# EasyEDA Pro project MatricClock.eprj

# Schematic Schematic1
Board Name: Board1; Create Date: 2025-01-13; Page Name: P1; Project Name: MatricClock; Schematic Name: Schematic1; Update Date: 2025-01-19; Company: 嘉立创EDA; Page Size: A4; Version: V1.0
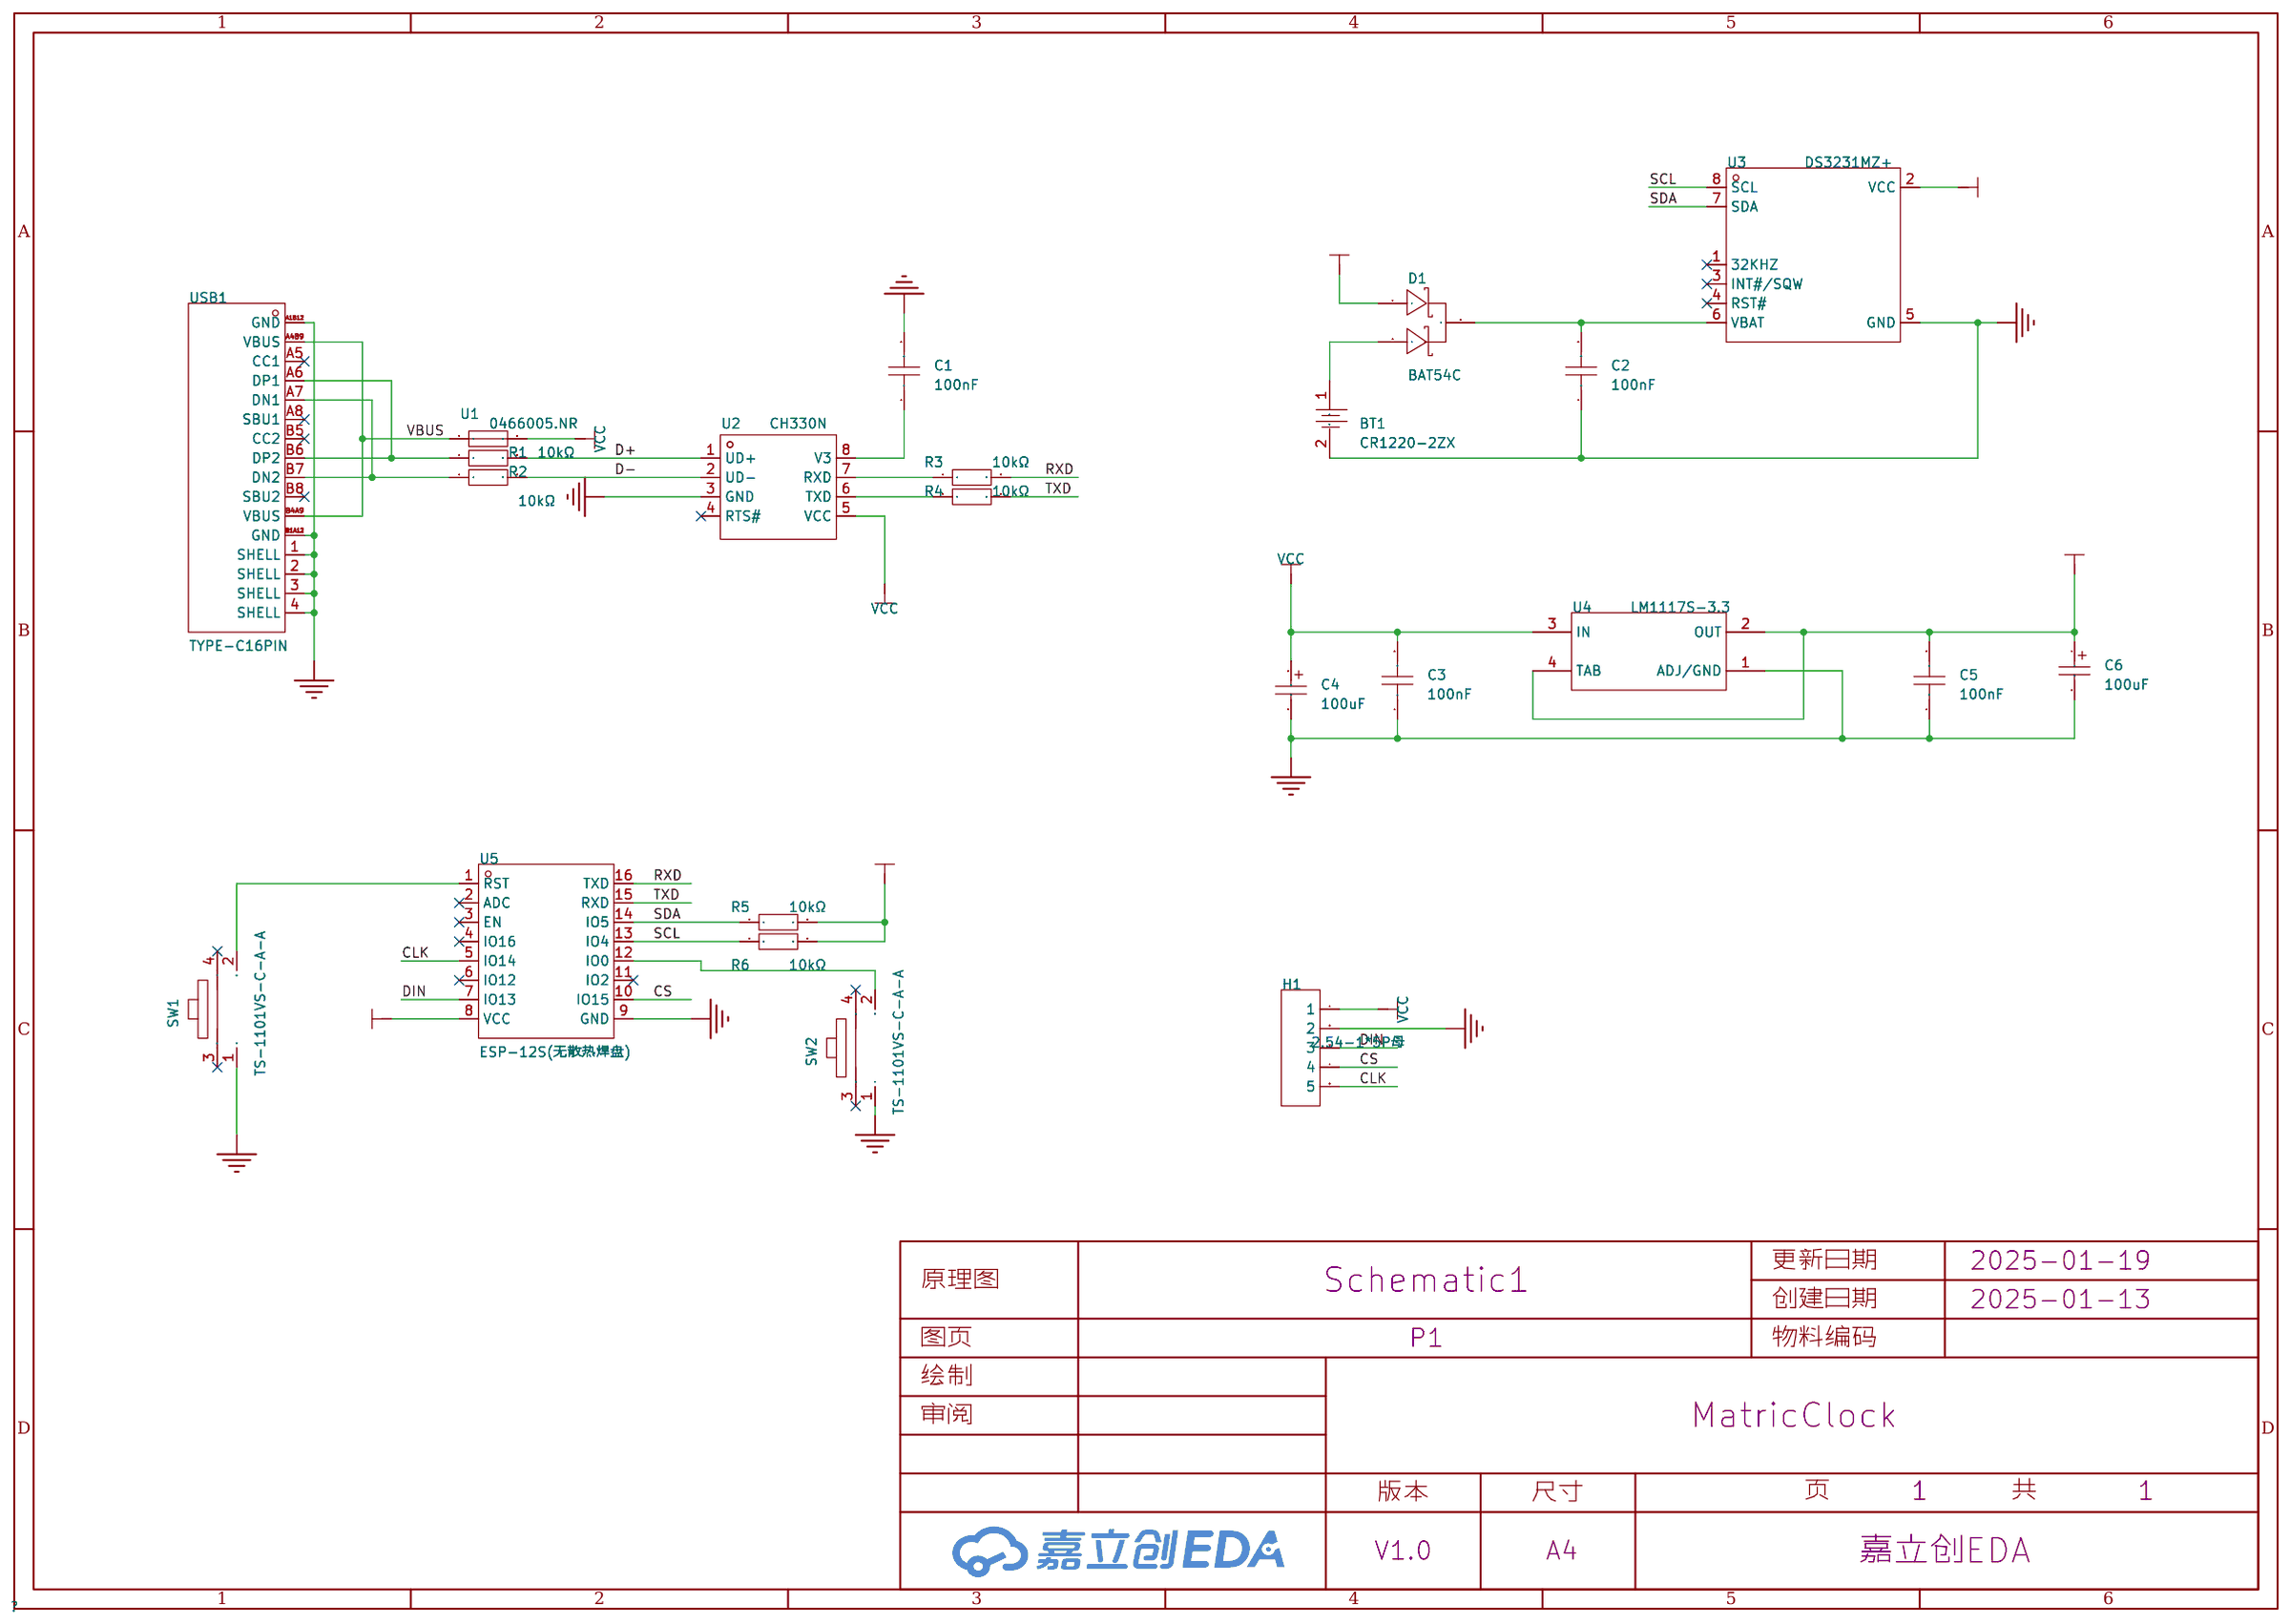
[diagram p0: schematic sheet]

## Parts
BT1  CR1220-2ZX  [BAT-SMD_CR1220-2ZX]
C1  100nF  [C0805]
C2  100nF  [C0805]
C3  100nF  [C0805]
C4  100uF  [CASE-B_3528]
C5  100nF  [C0805]
C6  100uF  [CASE-B_3528]
D1  BAT54C  [SOT-23-3_L3.0-W1.7-P0.95-LS2.9-BR]
H1  2.54-1*5P母  [HDR-TH_5P-P2.54-V-F]
R1  10kΩ  [R0603]
R2  10kΩ  [R0603]
R3  10kΩ  [R0603]
R4  10kΩ  [R0603]
R5  10kΩ  [R0603]
R6  10kΩ  [R0603]
SW1  TS-1101VS-C-A-A  [KEY-SMD_TS-1101VS-C-A-A]
SW2  TS-1101VS-C-A-A  [KEY-SMD_TS-1101VS-C-A-A]
U1  0466005.NR  [F1206]
U2  CH330N  [SOP-8_L4.9-W3.9-P1.27-LS6.0-BL]
U3  DS3231MZ+  [SOIC-8_L4.9-W3.9-P1.27-LS6.0-BL-EP3.4]
U4  LM1117S-3.3  [SOT-223-3_L6.5-W3.4-P2.30-LS7.0-BR]
U5  ESP-12S(无散热焊盘)  [WIRELM-SMD_ESP-12S-1]
USB1  TYPE-C16PIN  [USB-C-SMD_TYPE-C16PIN]

## Library data of the parts
BT1 = CR1220-2ZX: Supplier Part: C969906; Manufacturer: Q&J; Supplier Footprint: SMD; JLCPCB Part Class: 扩展库; Datasheet: https://atta.szlcsc.com/upload/public/pdf/source/20210107/C969906_C1D85B5C66CBBA4D1AEB8467FE1CEC7A.pdf; Supplier: LCSC; Connector Type: 电池底座; Battery Type: CR1220; Operating Temperature Range: -25℃~+85℃
C1-C3 C5 = CC0805KRX7R9BB104: LCSC Part Name: 100nF ±10% 50V; Supplier Part: C49678; Manufacturer: YAGEO(国巨); Supplier Footprint: 0805; JLCPCB Part Class: Basic Part; Datasheet: https://atta.szlcsc.com/upload/public/pdf/source/20180224/C181747_15194369449651363981.pdf; Supplier: LCSC; Tolerance: ±10%; Voltage Rated: 50V; Temperature Coefficient: X7R
C4 C6 = TAJB107M010RNJ: LCSC Part Name: 100uF ±20% 10V; Supplier Part: C7196; Manufacturer: Kyocera AVX; Supplier Footprint: CASE-B-3528; JLCPCB Part Class: Extended Part; Datasheet: https://atta.szlcsc.com/upload/public/pdf/source/20160107/1457707750344.pdf; Supplier: LCSC; Tolerance: ±20%; Rated Voltage: 10V; Equivalent Series Resistance(ESR): 1.4Ω@100kHz; Operating Temperature: -55℃~+125℃
D1 = BAT54C_C179728: LCSC Part Name: 电压:30V 电流:200mA; Supplier Part: C179728; Manufacturer: HT(金誉); Supplier Footprint: SOT-23; JLCPCB Part Class: Extended Part; Datasheet: https://atta.szlcsc.com/upload/public/pdf/source/20190327/C179728_2385874176C86A00C35A9968B7AEEC1C.pdf; Supplier: LCSC; Forward Voltage (Vf@If): 1V@100mA; Reverse Voltage (Vr): 30V; Average Rectified Current (Io): 200mA
H1 = 2.54-1*5P母: LCSC Part Name: 间距:2.54mm 1x5P 直插; Supplier Part: C50950; Manufacturer: BOOMELE(博穆精密); Supplier Footprint: 插件,P=2.54mm; JLCPCB Part Class: Extended Part; Datasheet: https://atta.szlcsc.com/upload/public/pdf/source/20210301/C2718488_F4427B881E42CAA8DDB0B1C12B3A522C.pdf; Supplier: LCSC; Holes Structure: 1x5P; Pitch: 2.54mm; Mounting Type: 直插; Number of Rows: 单排; Number of Holes: 5P
R1-R6 = 0603WAF1002T5E: LCSC Part Name: 厚膜电阻 10kΩ ±1% 100mW; Supplier Part: C25804; Manufacturer: UNI-ROYAL(厚声); Supplier Footprint: 0603; JLCPCB Part Class: Basic Part; Datasheet: https://atta.szlcsc.com/upload/public/pdf/source/20200306/C422600_1E6D84923E4A46A82E41ADD87F860B5C.pdf; Supplier: LCSC; Type: 厚膜电阻; Tolerance: ±1%; Power(Watts): 100mW; Overload Voltage (Max): 75V; Temperature Coefficient: ±100ppm/℃; Operating Temperature Range: -55℃~+155℃
SW1 SW2 = TS-1101VS-C-A-A: LCSC Part Name: 7*2.5*3.5mm 卧贴 轻触开关; Supplier Part: C318936; Manufacturer: XKB Connectivity(中国星坤); Supplier Footprint: SMD; JLCPCB Part Class: Extended Part; Datasheet: https://atta.szlcsc.com/upload/public/pdf/source/20211011/3EC7F7473F2EE0EB3A7179674E79B771.pdf; Supplier: LCSC; Circuit: 单刀单掷; Actuator Style: 矩形按钮; Operating Force: 260gf; Mounting Style: 卧贴; Switch Length: 7mm; Switch Width: 2.5mm; Switch Height: 3.5mm; Strike Gundam: 不带; Contact Current: 50mA; Voltage Rating (DC): 12V; Actuator/Cap Color: 黑色; With Lamp: 无; Mechanical Life: 5万次; Operating Temperature: -30℃~+85℃
U1 = 0466005.NR: LCSC Part Name: 32V贴片式保险丝; Supplier Part: C187597; Manufacturer: Littelfuse(美国力特); Supplier Footprint: 1206; JLCPCB Part Class: 扩展库; Datasheet: https://atta.szlcsc.com/upload/public/pdf/source/20180717/C206988_5F0E1BFD05A279C65E5494FD60374951.pdf; Supplier: LCSC; Type: 贴片式保险丝; Current Rating: 5A; Voltage Rating  (AC): 32V; Voltage Rating (DC): 32V; Operating Temperature: -55℃~+90℃; Breaking Capacity: 50A
U2 = CH330N: LCSC Part Name: CH330N 停产; Supplier Part: C108996; Manufacturer: WCH(南京沁恒); Supplier Footprint: SOP-8; JLCPCB Part Class: 扩展库; Datasheet: https://atta.szlcsc.com/upload/public/pdf/source/20240313/064151622E5EBEB2C93E60CEFC89359A.pdf; Supplier: LCSC; Applications Function: 收发器; Protocol: USB 2.0; Supply Voltage: 3.3V；5V; Data Rate: 2Mbps
U3 = DS3231MZ+: Supplier Part: C722467; Manufacturer: ADI(亚德诺)/MAXIM(美信); Supplier Footprint: SOIC-8; JLCPCB Part Class: Extended Part; Datasheet: https://atta.szlcsc.com/upload/public/pdf/source/20170620/1497944726830.pdf; Supplier: LCSC; Interface: I2C; Operating Voltage: 2.3V~5.5V; Operating Temperature: -40℃~+85℃
U4 = LM1117S-3.3: LCSC Part Name: 输入12V 输出3.3V 1A; Supplier Part: C126027; Manufacturer: HTC; Supplier Footprint: SOT-223-3; JLCPCB Part Class: Extended Part; Datasheet: https://atta.szlcsc.com/upload/public/pdf/source/20170814/C126029_1502678374361885901.pdf; Supplier: LCSC; Output Type: 固定; Maximum Input Voltage: 12V; Output Voltage: 3.3V; MAX Output Current: 1A; Power Supply Rejection Ratio (PSRR): 75dB@(120Hz); Dropout Voltage: 1.3V@(1A); Output Polarity: 正极; Number of Outputs: 1
U5 = ESP-12S(无散热焊盘): Supplier Part: C3034948; Supplier Footprint: SMD-16P; JLCPCB Part Class: Extended Part; Supplier: LCSC
USB1 = TYPE-C16PIN: LCSC Part Name: Type-C 母 卧贴; Supplier Part: C393939; Manufacturer: SHOU HAN(首韩); Supplier Footprint: SMD; JLCPCB Part Class: Extended Part; Datasheet: https://atta.szlcsc.com/upload/public/pdf/source/20190521/C393939_7B9043D4CF1026AF443AB60D91FBCD5C.pdf; Supplier: LCSC; Connector Type: Type-C; Standard: USB 3.1; Gender: 母; Mounting Style: 卧贴; Number of Contacts: 16P; Number of Ports: 1; Current Rating - Power (Max): 3A; Operating Temperature Range: -40℃~+85℃; Rated Voltage (Max): 30V; Connect-Disconnect Life: 1万次; Core Colour: 黑色

## Nets
+3.3V: C5.2 C6.1 D1.1(A) R5.2 R6.2 U3.2(VCC) U4.2(OUT) U4.4(TAB) U5.8(VCC)
GND: BT1.2 C1.2 C2.1 C3.1 C4.2 C5.1 C6.2 H1.2 SW1.1 SW2.1 U2.3(GND) U3.5(GND) U4.1(ADJ/GND) U5.9(GND) USB1.1(SHELL) USB1.2(SHELL) USB1.3(SHELL) USB1.4(SHELL) USB1.A1B12(GND) USB1.B1A12(GND)
VBUS: U1.1 USB1.A4B9(VBUS) USB1.B4A9(VBUS)
VCC: C3.2 C4.1 H1.1 U1.2 U2.5(VCC) U4.3(IN)
CLK: H1.5 U5.5(IO14)
CS: H1.4 U5.10(IO15)
D+: R1.2 U2.1(UD+)
D-: R2.2 U2.2(UD-)
DIN: H1.3 U5.7(IO13)
RXD: R3.2 U5.16(TXD)
SCL: R6.1 U3.8(SCL) U5.13(IO4)
SDA: R5.1 U3.7(SDA) U5.14(IO5)
TXD: R4.2 U5.15(RXD)
$1N3733: R1.1 USB1.A6(DP1) USB1.B6(DP2)
$1N3759: R2.1 USB1.A7(DN1) USB1.B7(DN2)
$1N3955: R4.1 U2.6(TXD)
$1N3959: R3.1 U2.7(RXD)
$1N3986: C1.1 U2.8(V3)
$1N4062: C2.2 D1.3(K) U3.6(VBAT)
$1N4106: BT1.1 D1.2(A)
$1N4915: SW1.2 U5.1(RST)
$1N5017: SW2.2 U5.12(IO0)

Not connected (* = marked no-connect by the designer): SW1 3* 4*; SW2 3* 4*; U2 4(RTS#)*; U3 1(32KHZ)* 3(INT#/SQW)* 4(RST#)*; U5 2(ADC)* 3(EN)* 4(IO16)* 6(IO12)* 11(IO2)*; USB1 A5(CC1)* A8(SBU1)* B5(CC2)* B8(SBU2)*

# Schematic Schematic2
Board Name: Board2; Create Date: 2025-01-14; Page Name: P1; Project Name: MatricClock; Schematic Name: Schematic2; Update Date: 2025-01-19; Company: 嘉立创EDA; Page Size: A4; Version: V1.0
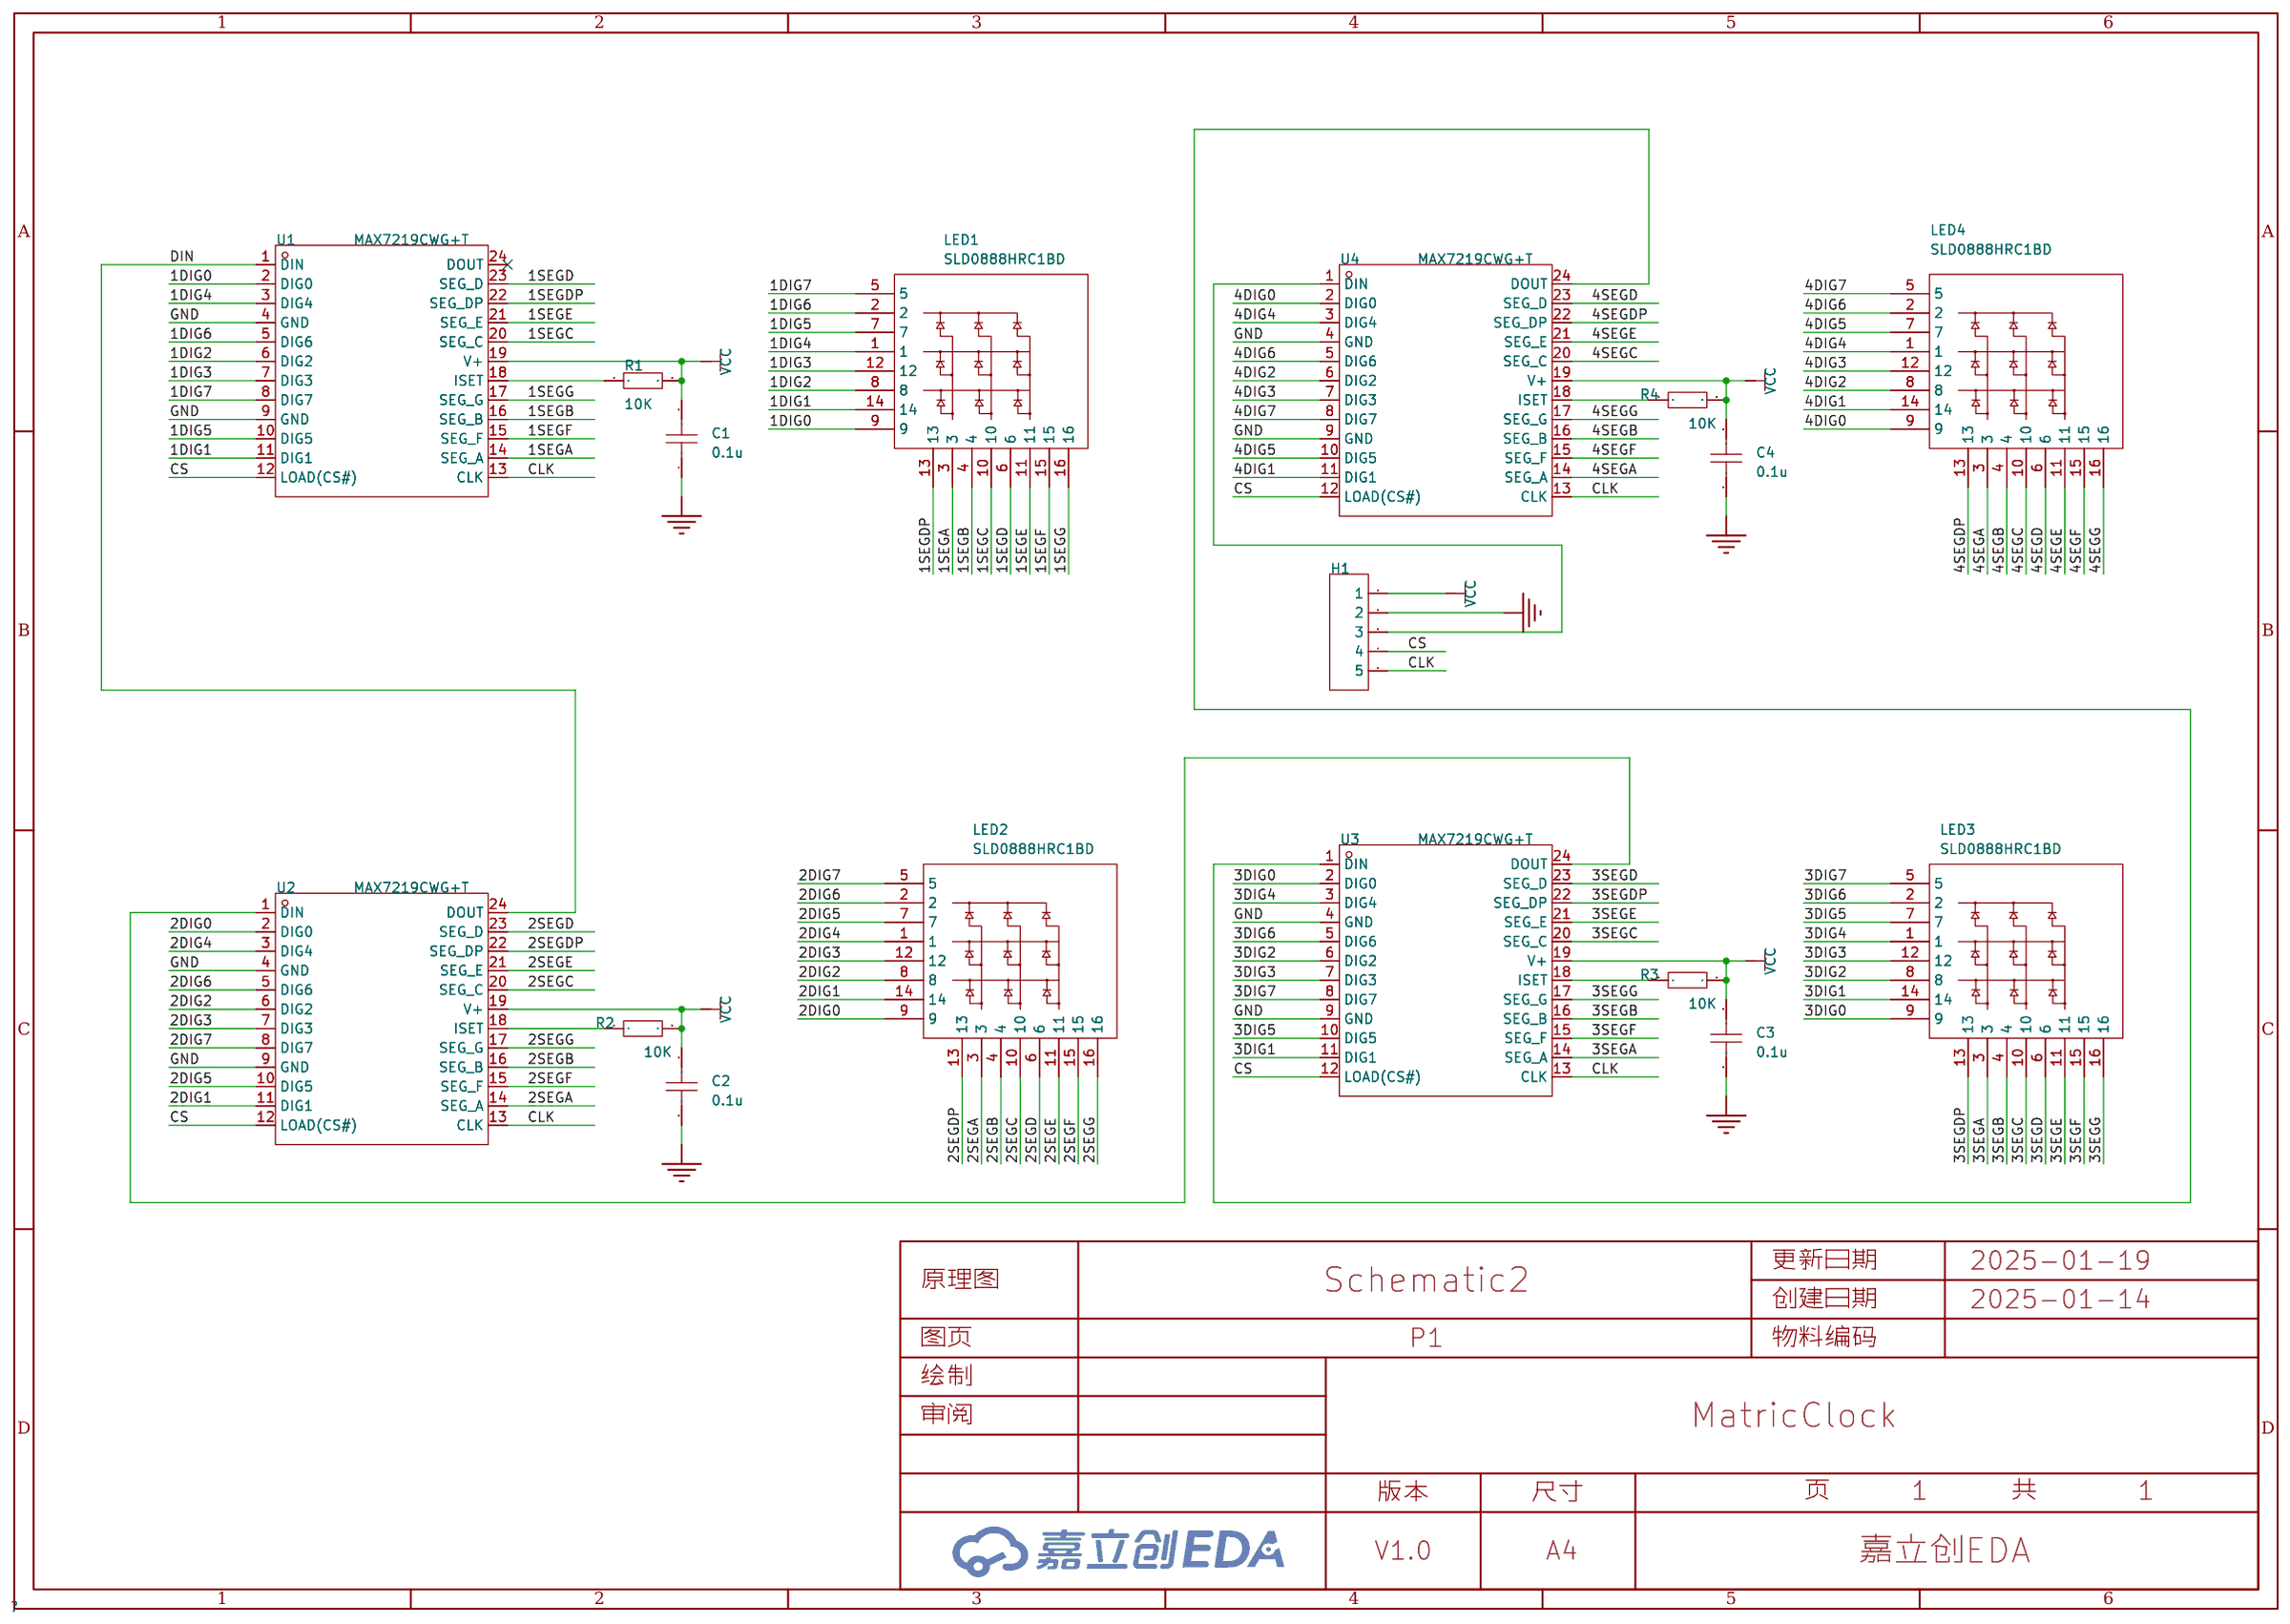
[diagram p1: schematic sheet]

## Parts
C1  0.1u  [C0805]
C2  0.1u  [C0805]
C3  0.1u  [C0805]
C4  0.1u  [C0805]
H1  -  [HDR-TH_5P-P2.54-V-F]
LED1  SLD0888HRC1BD  [LED-SEG-TH_16P-L20.0-W20.0-P2.50-S15.0-BL-1]
LED2  SLD0888HRC1BD  [LED-SEG-TH_16P-L20.0-W20.0-P2.50-S15.0-BL-1]
LED3  SLD0888HRC1BD  [LED-SEG-TH_16P-L20.0-W20.0-P2.50-S15.0-BL-1]
LED4  SLD0888HRC1BD  [LED-SEG-TH_16P-L20.0-W20.0-P2.50-S15.0-BL-1]
R1  10K  [R0603]
R2  10K  [R0603]
R3  10K  [R0603]
R4  10K  [R0603]
U1  MAX7219CWG+T  [SOIC-24_L15.4-W7.5-P1.27-LS10.3-BL]
U2  MAX7219CWG+T  [SOIC-24_L15.4-W7.5-P1.27-LS10.3-BL]
U3  MAX7219CWG+T  [SOIC-24_L15.4-W7.5-P1.27-LS10.3-BL]
U4  MAX7219CWG+T  [SOIC-24_L15.4-W7.5-P1.27-LS10.3-BL]

## Library data of the parts
C1-C4 = CAP_0603: Supplier Footprint: 0603
H1 = HDR-F_2.54_1x5P: Supplier Part: C50950; Supplier Footprint: 插件
LED1-LED4 = SLD0888HRC1BD: LCSC Part Name: 8x8位共阴极红色LED点阵; Supplier Part: C225985; Manufacturer: SUNLIGHT(光华); Supplier Footprint: 插件; JLCPCB Part Class: 扩展库; Datasheet: https://atta.szlcsc.com/upload/public/pdf/source/20180608/C225985_43E6E19EA73F5865773790A87A7F1678.pdf; Supplier: LCSC; Dot Matrix Number: 8x8; Emitting Color: 红色; Polarity: 共阴极
R1-R4 = Res_0603: Supplier Footprint: 0603
U1-U4 = MAX7219CWG+T: LCSC Part Name: 串行接口8位LED显示器驱动器; Supplier Part: C9964; Manufacturer: ADI(亚德诺)/MAXIM(美信); Supplier Footprint: SOIC-24-300mil; JLCPCB Part Class: Extended Part; Datasheet: https://atta.szlcsc.com/upload/public/pdf/source/20121117/1457706559786.pdf; Supplier: LCSC; Configuration: 7段,DP; Interface Type: 4线串行接口; Supply Voltage: 4V~5.5V; Operating Temperature: 0℃~+70℃

## Nets
GND: C1.1 C2.1 C3.1 C4.1 H1.2 U1.4(GND) U1.9(GND) U2.4(GND) U2.9(GND) U3.4(GND) U3.9(GND) U4.4(GND) U4.9(GND)
VCC: C1.2 C2.2 C3.2 C4.2 H1.1 R1.2 R2.2 R3.2 R4.2 U1.19(V+) U2.19(V+) U3.19(V+) U4.19(V+)
1DIG0: LED1.9 U1.2(DIG0)
1DIG1: LED1.14 U1.11(DIG1)
1DIG2: LED1.8 U1.6(DIG2)
1DIG3: LED1.12 U1.7(DIG3)
1DIG4: LED1.1 U1.3(DIG4)
1DIG5: LED1.7 U1.10(DIG5)
1DIG6: LED1.2 U1.5(DIG6)
1DIG7: LED1.5 U1.8(DIG7)
1SEGA: LED1.3 U1.14(SEG A)
1SEGB: LED1.4 U1.16(SEG B)
1SEGC: LED1.10 U1.20(SEG C)
1SEGD: LED1.6 U1.23(SEG D)
1SEGDP: LED1.13 U1.22(SEG DP)
1SEGE: LED1.11 U1.21(SEG E)
1SEGF: LED1.15 U1.15(SEG F)
1SEGG: LED1.16 U1.17(SEG G)
2DIG0: LED2.9 U2.2(DIG0)
2DIG1: LED2.14 U2.11(DIG1)
2DIG2: LED2.8 U2.6(DIG2)
2DIG3: LED2.12 U2.7(DIG3)
2DIG4: LED2.1 U2.3(DIG4)
2DIG5: LED2.7 U2.10(DIG5)
2DIG6: LED2.2 U2.5(DIG6)
2DIG7: LED2.5 U2.8(DIG7)
2SEGA: LED2.3 U2.14(SEG A)
2SEGB: LED2.4 U2.16(SEG B)
2SEGC: LED2.10 U2.20(SEG C)
2SEGD: LED2.6 U2.23(SEG D)
2SEGDP: LED2.13 U2.22(SEG DP)
2SEGE: LED2.11 U2.21(SEG E)
2SEGF: LED2.15 U2.15(SEG F)
2SEGG: LED2.16 U2.17(SEG G)
3DIG0: LED3.9 U3.2(DIG0)
3DIG1: LED3.14 U3.11(DIG1)
3DIG2: LED3.8 U3.6(DIG2)
3DIG3: LED3.12 U3.7(DIG3)
3DIG4: LED3.1 U3.3(DIG4)
3DIG5: LED3.7 U3.10(DIG5)
3DIG6: LED3.2 U3.5(DIG6)
3DIG7: LED3.5 U3.8(DIG7)
3SEGA: LED3.3 U3.14(SEG A)
3SEGB: LED3.4 U3.16(SEG B)
3SEGC: LED3.10 U3.20(SEG C)
3SEGD: LED3.6 U3.23(SEG D)
3SEGDP: LED3.13 U3.22(SEG DP)
3SEGE: LED3.11 U3.21(SEG E)
3SEGF: LED3.15 U3.15(SEG F)
3SEGG: LED3.16 U3.17(SEG G)
4DIG0: LED4.9 U4.2(DIG0)
4DIG1: LED4.14 U4.11(DIG1)
4DIG2: LED4.8 U4.6(DIG2)
4DIG3: LED4.12 U4.7(DIG3)
4DIG4: LED4.1 U4.3(DIG4)
4DIG5: LED4.7 U4.10(DIG5)
4DIG6: LED4.2 U4.5(DIG6)
4DIG7: LED4.5 U4.8(DIG7)
4SEGA: LED4.3 U4.14(SEG A)
4SEGB: LED4.4 U4.16(SEG B)
4SEGC: LED4.10 U4.20(SEG C)
4SEGD: LED4.6 U4.23(SEG D)
4SEGDP: LED4.13 U4.22(SEG DP)
4SEGE: LED4.11 U4.21(SEG E)
4SEGF: LED4.15 U4.15(SEG F)
4SEGG: LED4.16 U4.17(SEG G)
CLK: H1.5 U1.13(CLK) U2.13(CLK) U3.13(CLK) U4.13(CLK)
CS: H1.4 U1.12(LOAD(CS#)) U2.12(LOAD(CS#)) U3.12(LOAD(CS#)) U4.12(LOAD(CS#))
DIN: U1.1(DIN) U2.24(DOUT)
$1N1570: R1.1 U1.18(ISET)
$1N1807: R2.1 U2.18(ISET)
$1N1816: U2.1(DIN) U3.24(DOUT)
$1N1982: R3.1 U3.18(ISET)
$1N1984: U3.1(DIN) U4.24(DOUT)
$1N2147: R4.1 U4.18(ISET)
$1N2277: H1.3 U4.1(DIN)

Not connected (* = marked no-connect by the designer): U1 24(DOUT)*

# Board PCB1
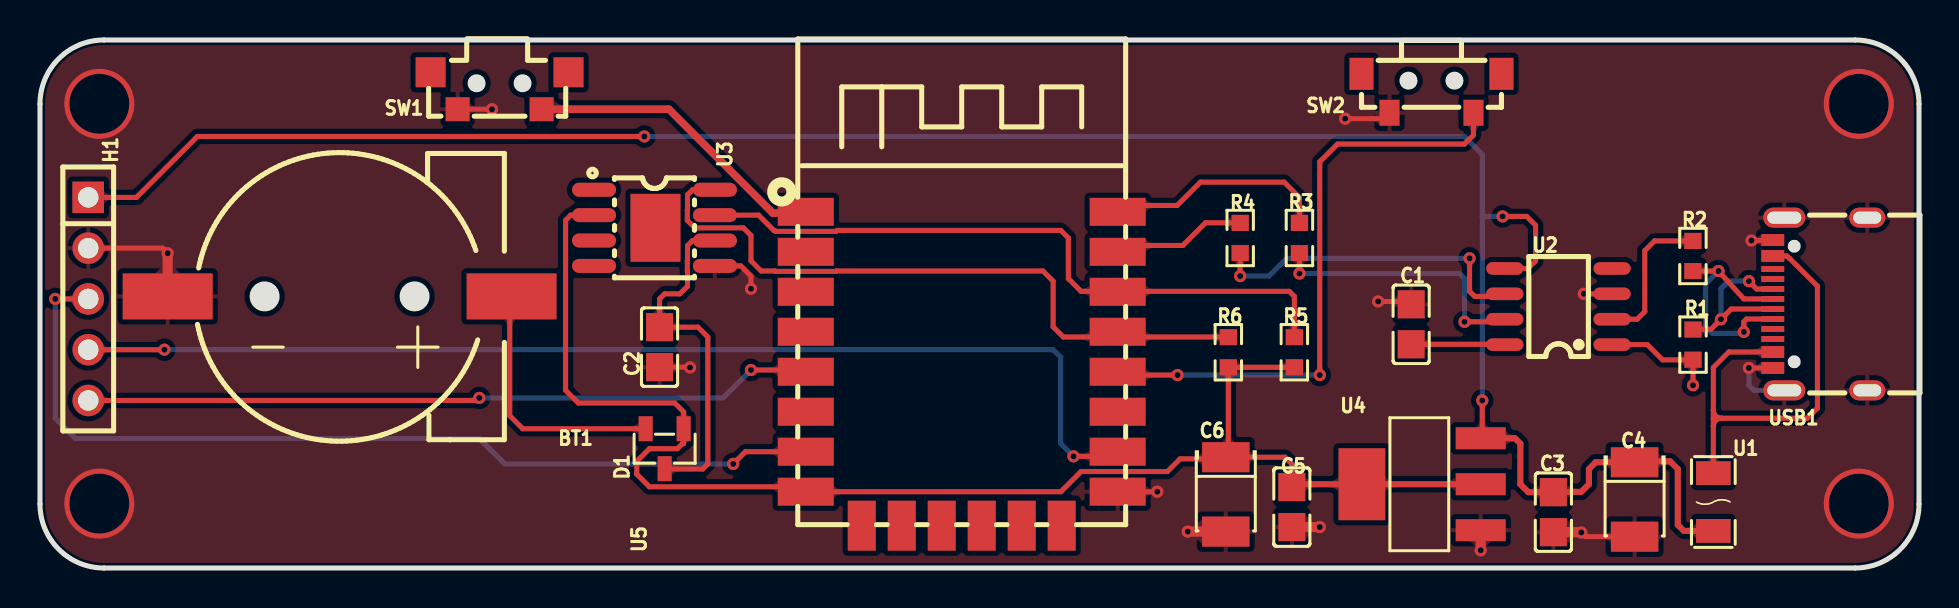
[diagram p2: board, top side]
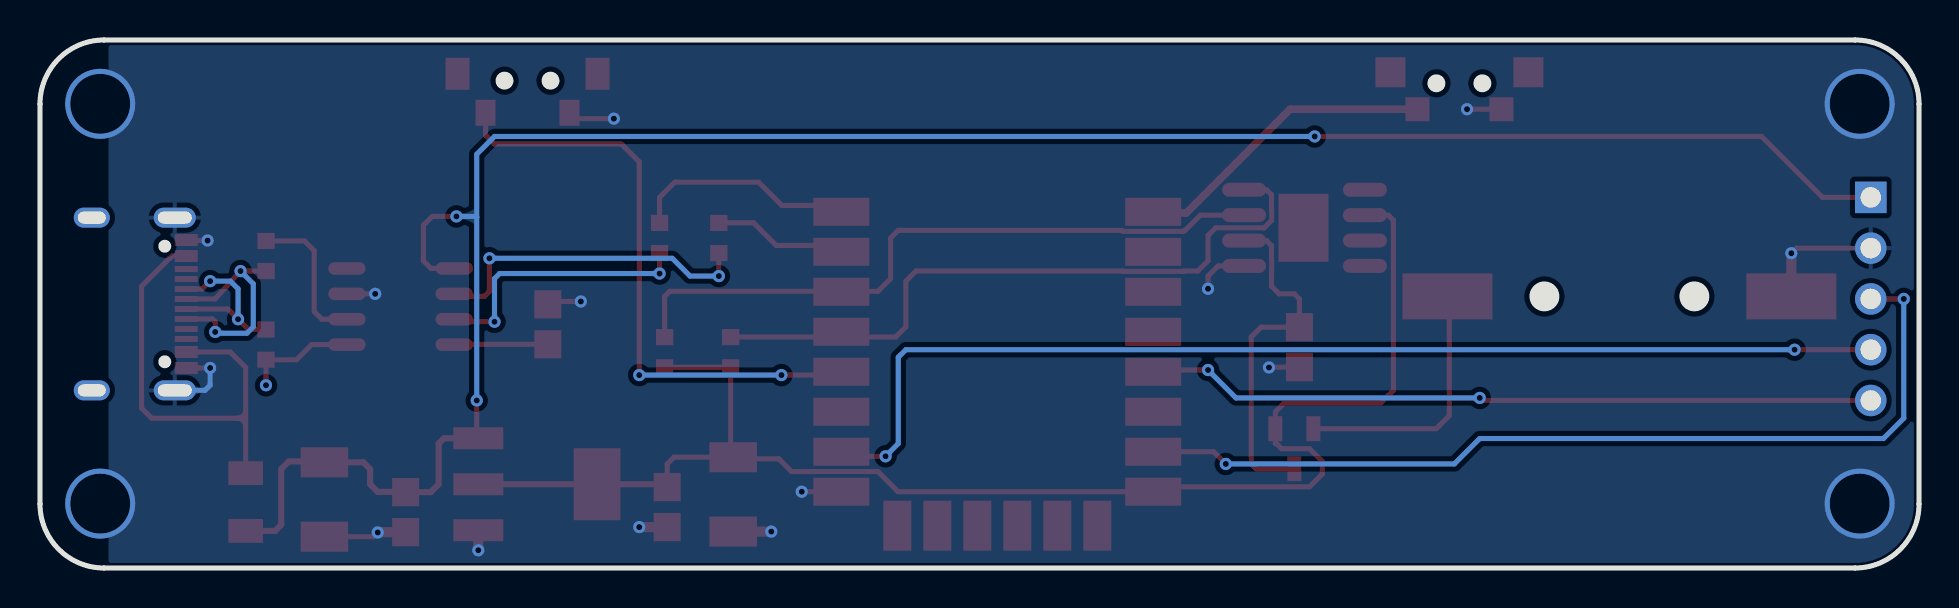
[diagram p3: board, bottom side, seen from below]

Outline 93.98 x 26.42 mm; copper layers: Top Layer, Bottom Layer. Coordinates in mm from the lower left corner of the outline.
Outline path: 0,23.22 0,3.2 arc(0.94,0.94) 3.2,0 90.78,0 arc(93.04,0.94) 93.98,3.2 93.98,23.22 arc(93.04,25.48) 90.78,26.42 3.2,26.42 arc(0.94,25.48) 0,23.22
Stack: Top Layer 0.035mm / Dielectric1 1.51mm FR4 er 4.5 / Bottom Layer 0.035mm

## Design rules (mm)
template: JLCPCB Capability(Two Layers Board)
spacing copperThickness1oz (default): track to track 0.102, other pairs 0.152 to 0.3
spacing copperThickness2oz: track to track 0.203, other pairs 0.152 to 0.3
track width copperThickness1oz (default): min 0.127, default 0.254, max 2.54
track width copperThickness2oz: min 0.203, default 0.254, max 2.54
differential pair differentialPair (default): width min 0.127, default 0.254, max 2.54; gap min 0.152, default 0.152
via viaSize (default): diameter min 0.5, default 0.61, max 10; hole min 0.3, default 0.305, max 6.3

## Placement (name value [footprint] x y rotation side)
BT1  CR1220-2ZX  [BAT-SMD_CR1220-2ZX]  14.99 13.59 180 top
C1  100nF  [C0805]  68.58 12.19 90 top
C2  100nF  [C0805]  30.99 11.05 90 top
C3  100nF  [C0805]  75.69 2.79 90 top
C4  100uF  [CASE-B_3528]  79.76 3.43 270 top
C5  100nF  [C0805]  62.61 3.05 90 top
C6  100uF  [CASE-B_3528]  59.31 3.68 270 top
D1  BAT54C  [SOT-23-3_L2.9-W1.3-P1.90-LS2.4-BR]  31.24 5.97 90 top
H1  2.54-1*5P母  [HDR-TH_5P-P2.54-V-F]  2.41 13.46 270 top
R1  10kΩ  [R0603]  82.68 11.18 270 top
R2  10kΩ  [R0603]  82.67 15.61 90 top
R3  10kΩ  [R0603]  62.99 16.51 90 top
R4  10kΩ  [R0603]  60.03 16.51 90 top
R5  10kΩ  [R0603]  62.74 10.79 270 top
R6  10kΩ  [R0603]  59.44 10.79 270 top
SW1  TS-1101VS-C-A-A  [KEY-SMD_4P-L7.8-W2.8-P4.20-EH]  22.99 23.88 0 top
SW2  TS-1101VS-C-A-A  [KEY-SMD_TS-1101VS-C-A-A]  69.6 23.75 0 top
U1  0466005.NR  [F1206]  83.69 3.3 270 top
U2  CH330N  [SOP-8_L4.9-W3.9-P1.27-LS6.0-BL]  75.95 13.08 90 top
U3  DS3231MZ+  [SOIC-8_L4.9-W3.9-P1.27-LS6.0-BL-EP3.4]  30.73 17.02 270 top
U4  LM1117S-3.3  [SOT-223-3_L6.5-W3.4-P2.30-LS7.0-BR]  69.09 4.19 0 top
U5  ESP-12S(无散热焊盘)  [WIFIM-SMD_22P-L24.0-W16.0-P2.00]  46.1 9.97 90 top
USB1  TYPE-C16PIN  [USB-C-SMD_TYPE-C16PIN]  89.03 13.21 90 top

## Footprints (pads in the part's own frame, mm; a bottom-side part is the same pattern mirrored in y, then rotated)
BAT-SMD_CR1220-2ZX
  rect 4.5x2.3 smd: 1(-8.6,0) 2(8.6,0)
C0805
  rect 1.41x1.35 smd: 1(-1,0) 2(1,0)
CASE-B_3528
  rect 1.506x2.376 smd: 1(-1.861,0) 2(1.861,0)
F1206
  rect 1.19x1.728 smd: 1(-1.445,0) 2(1.445,0)
HDR-TH_5P-P2.54-V-F
  rect 1.575x1.575 hole 1.02: 1(-5.08,0)
  round 1.575 hole 1.02: 2(-2.54,0) 3(0,0) 4(2.54,0) 5(5.08,0)
KEY-SMD_4P-L7.8-W2.8-P4.20-EH
  rect 1.2x1.2 smd: 1(-2.1,-0.924) 2(2.1,-0.924)
  rect 1.5x1.5 smd: 3(-3.45,0.924) 4(3.45,0.924)
KEY-SMD_TS-1101VS-C-A-A
  rect 1x1.3 smd: 1(-2.1,-0.975) 2(2.1,-0.975)
  rect 1.2x1.6 smd: 3(-3.5,0.975) 4(3.5,0.975)
R0603
  rect 0.806x0.864 smd: 1(-0.753,0) 2(0.753,0)
SOIC-8_L4.9-W3.9-P1.27-LS6.0-BL-EP3.4
  oval 0.7x2.2 smd: 1(-1.905,-3.022) 2(-0.635,-3.022) 3(0.635,-3.022) 4(1.905,-3.022) 5(1.905,3.022) 6(0.635,3.022) 7(-0.635,3.022) 8(-1.905,3.022)
  rect 3.4x2.5 smd: 9(0,0.051)
SOP-8_L4.9-W3.9-P1.27-LS6.0-BL
  oval 0.63x1.865 smd: 1(-1.905,-2.683) 2(-0.635,-2.683) 3(0.635,-2.683) 4(1.905,-2.683) 5(1.905,2.683) 6(0.635,2.683) 7(-0.635,2.683) 8(-1.905,2.683)
SOT-23-3_L2.9-W1.3-P1.90-LS2.4-BR
  rect 1.25x0.7 smd: 1(1,-0.95) 2(1,0.95) 3(-1,0)
SOT-223-3_L6.5-W3.4-P2.30-LS7.0-BR
  rect 2.5x1.1 smd: 1(2.97,-2.3) 2(2.97,0) 3(2.97,2.3)
  rect 2.34x3.6 smd: 4(-2.97,0)
USB-C-SMD_TYPE-C16PIN
  oval 1x2.1 hole 0.6x1.7: 1(-4.32,1.788) 2(4.32,1.788)
  oval 1x1.8 hole 0.6x1.4: 3(-4.32,-2.362) 4(4.32,-2.362)
  rect 0.6x1.15 smd: A1B12(-3.2,2.362) A4B9(-2.4,2.362) B1A12(3.2,2.362) B4A9(2.4,2.362)
  rect 0.3x1.15 smd: A5(-1.25,2.362) A6(-0.25,2.362) A7(0.25,2.362) A8(1.25,2.362) B5(1.75,2.362) B6(0.75,2.362) B7(-0.75,2.362) B8(-1.75,2.362)
WIFIM-SMD_22P-L24.0-W16.0-P2.00
  rect 1.4x2.8 smd: 1(7.85,7.8) 2(5.85,7.8) 3(3.85,7.8) 4(1.85,7.8) 5(-0.15,7.8) 6(-2.15,7.8) 7(-4.15,7.8) 8(-6.15,7.8) 9(-6.15,-7.8) 10(-4.15,-7.8) 11(-2.15,-7.8) 12(-0.15,-7.8) 13(1.85,-7.8) 14(3.85,-7.8) 15(5.85,-7.8) 16(7.85,-7.8)
  rect 2.5x1.4 smd: 17(-7.85,5) 18(-7.85,3) 19(-7.85,1) 20(-7.85,-1) 21(-7.85,-3) 22(-7.85,-5)

## Nets
As in the schematic.

Pads without a net: SW1 3 4; SW2 3 4; U2 4; U3 1 3 4 9; U5 2 3 4 6 11 17 18 19 20 21 22; USB1 A5 A8 B5 B8

## Via types
v1: diameter 0.61, hole 0.305, Top Layer to Bottom Layer, 34 vias
v2: diameter 3.5, hole 3, Top Layer to Bottom Layer, 4 vias

## Routing (per net, layer and track width the routed paths; a pad name or vN(x,y) marks a point on that pad's centre or on a via; arc(x,y) is an arc through that point)
+3.3V: length 73.8
  Top Layer w0.254: R5.2 R6.2 59.44,5.67 C6.1 ; 38.3,4.14 38.23,4.06 30.48,4.06 29.85,4.7 29.85,5.33 30.48,5.97 31.88,5.97 32.13,6.22 32.19,6.22 D1.1 32.19,7.81 31.75,8.25 26.92,8.25 26.29,8.89 26.29,17.4 26.54,17.65 U3.2 ; C6.1 62.27,5.54 62.61,5.21 C5.2 ; C6.1 59.23,5.46 57.02,5.46 56.39,4.83 52.07,4.83 51.06,3.82 U5.8
  Top Layer w0.305: U4.2 U4.4 62.75,4.19 C5.2
GND: length 33
  Top Layer w0.254: v1(66.93,13.33) 68.44,13.33 C1.2 ; v1(77.09,1.78) 77.3,1.57 C4.2 ; SW2.1 67.2,22.48 v1(65.28,22.48) ; SW1.1 v1(22.61,22.95) ; 53.9,3.82 v1(55.88,3.82) ; v1(6.39,15.75) 6.13,16 H1.2 ; U3.5 35.05,15.11 35.56,14.6 v1(35.56,13.97) ; USB1.A1B12 v1(85.47,10.01) ; v1(85.6,16.38) 86.64,16.38 USB1.B1A12 ; U2.3 v1(77.22,13.72) ; v1(32.51,10.03) 32.5,10.05 C2.1
  Top Layer w0.508: C6.2 v1(57.4,1.82) ; C3.1 77.07,1.79 v1(77.09,1.78) ; C5.1 v1(64.01,2.05) ; U4.1 v1(72.06,0.89) ; BT1.2 v1(6.39,15.75)
  Bottom Layer w0.254: USB1.1 85.73,8.89 85.47,9.14 v1(85.47,10.01)
  vias: v2(2.97,23.22) v2(2.97,3.22) v2(90.97,23.22) v2(90.97,3.22)
VBUS: length 24.2
  Top Layer w0.254: 83.69,7.9 83.69,7.47 ; 83.69,7.9 83.69,10.03 84.47,10.81 USB1.A4B9 ; 83.69,7.9 arc(83.81,7.61) 84.1,7.49 ; 83.69,7.47 83.69,7.09 ; 83.69,7.47 83.71,7.49 84.1,7.49 ; 83.69,7.09 U1.1 ; 83.69,7.09 arc(83.81,7.37) 84.1,7.49 ; USB1.B4A9 87.38,15.61 87.49,15.49 87.5,15.49 88.9,14.1 88.9,8 88.39,7.49 84.1,7.49
VCC: length 110
  Top Layer w0.254: U4.3 72.14,6.57 v1(72.14,8.38) ; v1(30.23,21.59) 7.87,21.59 4.83,18.54 H1.1 ; v1(73.15,17.59) 74.36,17.59 74.8,17.14 74.8,15.37 74.42,14.99 U2.5
  Top Layer w0.305: U1.2 82.22,1.86 81.92,2.16 81.92,4.95 81.53,5.33 79.8,5.33 C4.1 77.81,5.29 77.47,4.95 77.47,4.19 77.09,3.81 75.71,3.81 C3.2 74.44,3.79 74.04,4.19 74.04,6.22 73.77,6.49 U4.3
  Bottom Layer w0.254: 72.14,17.55 72.17,17.59 v1(73.15,17.59) ; 72.14,17.55 72.14,20.7 71.25,21.59 v1(30.23,21.59) ; 72.14,17.55 v1(72.14,8.38)
CLK: length 36.6
  Top Layer w0.254: U5.5 38.21,9.91 v1(35.56,9.91) ; H1.5 21.84,8.38 v1(21.97,8.51)
  Bottom Layer w0.254: v1(35.56,9.91) 34.16,8.51 v1(21.97,8.51)
CS: length 56.3
  Top Layer w0.254: H1.4 v1(6.22,10.92) ; 53.9,5.82 53.67,5.59 v1(51.69,5.59)
  Bottom Layer w0.254: v1(51.69,5.59) 51.05,6.22 51.05,10.54 50.67,10.92 v1(6.22,10.92)
D+: length 5.6
  Top Layer w0.254: U2.1 80.39,11.18 81.15,10.41 82.67,10.41 R1.2 v1(82.68,9.14)
D-: length 7.5
  Top Layer w0.254: U2.2 79.88,12.45 80.26,12.83 80.26,15.88 80.75,16.36 R2.2
DIN: length 46.4
  Top Layer w0.254: v1(34.67,5.21) 35.28,5.82 U5.7 ; v1(0.76,13.46) H1.3
  Bottom Layer w0.254: v1(0.76,13.46) 0.76,7.49 1.78,6.48 21.97,6.48 23.24,5.21 v1(34.67,5.21)
RXD: length 11.2
  Top Layer w0.254: R3.2 62.99,18.54 62.23,19.3 58.04,19.3 56.87,18.14 53.9,18.14
SCL: length 34.3
  Top Layer w0.254: R6.1 59.43,11.56 51.18,11.56 50.67,12.06 50.67,14.35 50.17,14.86 39.84,14.86 39.82,14.84 36.79,14.84 36.77,14.86 36.07,14.86 35.56,15.37 35.56,16.64 35.18,17.02 32.77,17.02 32.76,17.02 32.75,17.02 32.38,17.39 32.38,17.91 32.39,17.92 32.39,18.67 32.64,18.92 33.76,18.92
SDA: length 33.9
  Top Layer w0.254: R5.1 62.74,13.59 62.48,13.84 52.07,13.84 51.44,14.48 51.44,16.51 51.05,16.89 39.87,16.89 39.82,16.84 36.79,16.84 36.73,16.89 36.7,16.89 35.94,17.65 U3.7
TXD: length 6.6
  Top Layer w0.254: R4.2 60.02,17.27 58.29,17.27 57.16,16.14 53.9,16.14
$1N3733: length 8.8
  Top Layer w0.254: USB1.A6 84.59,12.96 v1(84.07,12.45) 83.57,11.94 82.69,11.94 R1.1 ; USB1.B6 85.86,13.96 v1(85.47,14.35)
  Bottom Layer w0.254: v1(85.47,14.35) 84.45,14.35 84.07,13.97 v1(84.07,12.45)
$1N3759: length 11.7
  Top Layer w0.254: USB1.A7 86.66,13.46 85.22,13.46 v1(83.95,14.86) R2.1 ; v1(85.22,11.81) 85.22,12.32 85.36,12.46 USB1.B7
  Bottom Layer w0.254: v1(83.95,14.86) 83.31,14.22 83.31,12.06 83.63,11.75 85.15,11.75 v1(85.22,11.81)
$1N3955: length 16.6
  Top Layer w0.254: v1(71.5,15.49) 71.5,13.84 71.76,13.59 73.14,13.59 U2.6 ; R4.1 v1(60.03,14.6)
  Bottom Layer w0.254: v1(60.03,14.6) 61.47,14.6 62.36,15.49 v1(71.5,15.49)
$1N3959: length 13.6
  Top Layer w0.254: R3.1 v1(62.99,14.73) ; U2.7 73.14,12.32 v1(71.25,12.32)
  Bottom Layer w0.254: v1(62.99,14.73) 70.99,14.73 71.25,14.48 v1(71.25,12.32)
$1N3986: length 4.7
  Top Layer w0.254: U2.8 73.25,11.19 C1.1
$1N4062: length 17.8
  Top Layer w0.254: D1.3 31.26,4.95 33.15,4.95 33.4,5.21 33.4,11.56 32.91,12.05 C2.2 30.99,13.46 31.24,13.72 32,13.72 32.39,14.1 32.39,14.84 32.38,14.85 32.38,15.37 32.39,15.38 32.39,16.13 32.64,16.38 U3.6
$1N4106: length 13.1
  Top Layer w0.254: D1.2 24.15,6.97 23.5,7.62 23.5,13.5 BT1.1
$1N4915: length 15.5
  Top Layer w0.381: SW1.2 31.46,22.95 36.65,17.76 37.92,17.76 38.3,18.14
$1N5017: length 30.2
  Top Layer w0.254: v1(56.9,9.65) 54.07,9.65 53.9,9.82 ; SW2.2 71.7,21.66 71.25,21.21 64.9,21.21 64.01,20.32 v1(64.01,9.65)
  Bottom Layer w0.254: v1(64.01,9.65) v1(56.9,9.65)

## Copper pours and planes (outline as drawn; the poured copper is in the pictures)
GND on Top Layer: -8.89,29.21 102.74,29.21 102.74,-10.92 -8.89,-10.92
GND on Bottom Layer: -9.02,29.34 90.55,29.34 90.55,-7.24 -9.02,-7.24

Small or netless copper shapes (teardrops, artwork), in the pictures only: 120 on Top Layer, 20 on Bottom Layer

# Board PCB3
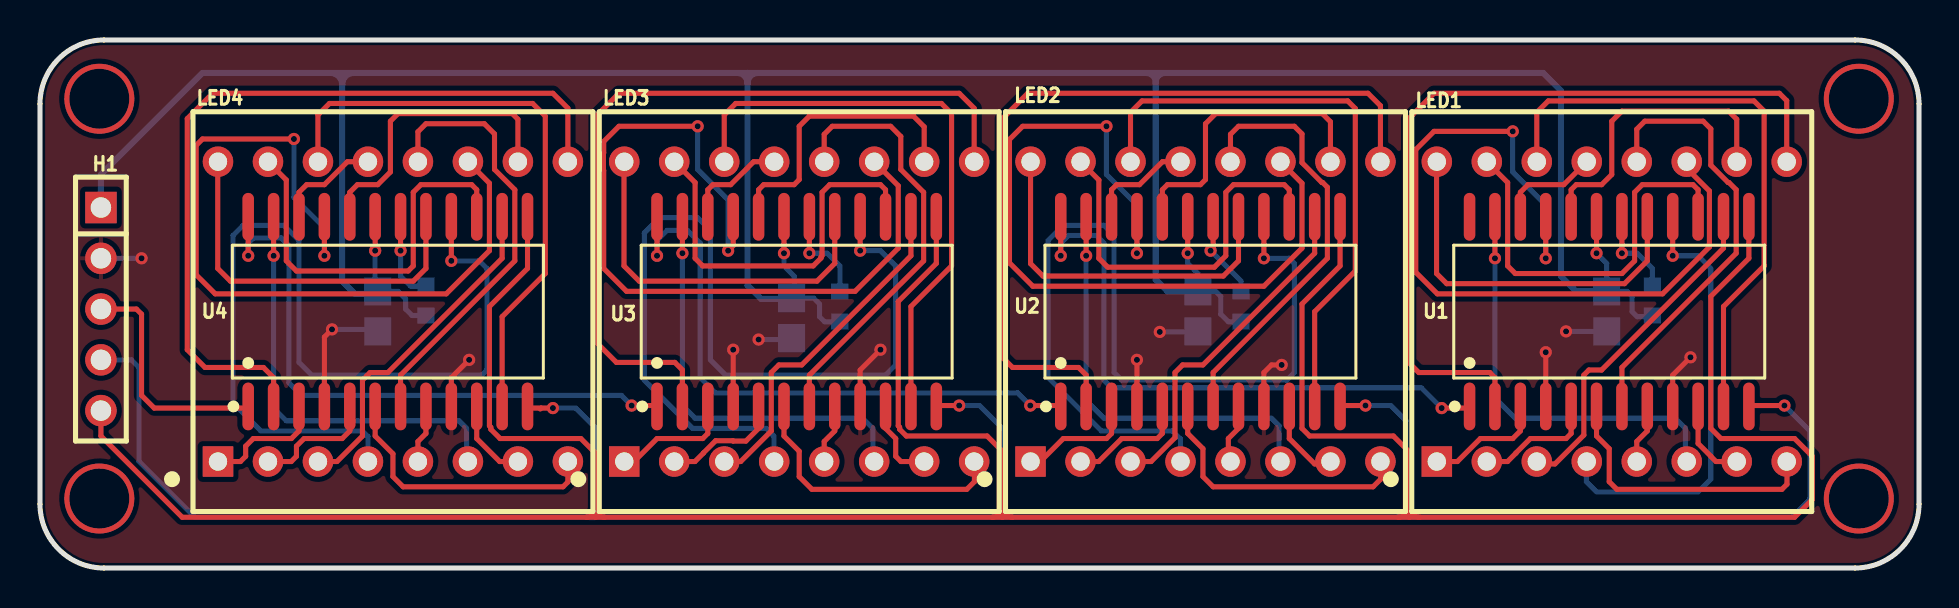
[diagram p4: board, top side]
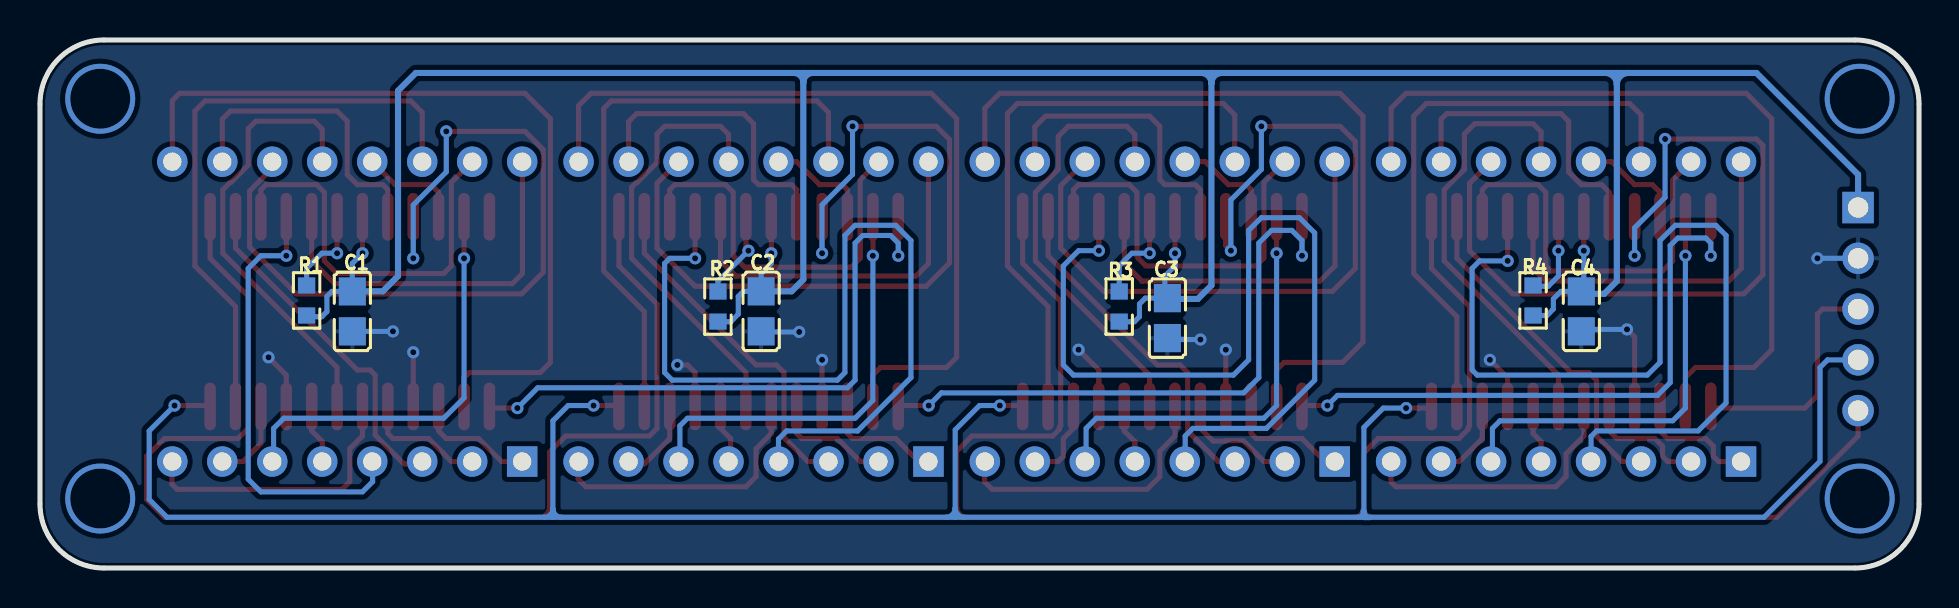
[diagram p5: board, bottom side, seen from below]

Outline 93.98 x 26.42 mm; copper layers: Top Layer, Bottom Layer. Coordinates in mm from the lower left corner of the outline.
Outline path: 0,23.22 0,3.2 arc(0.94,0.94) 3.2,0 90.78,0 arc(93.04,0.94) 93.98,3.2 93.98,23.22 arc(93.04,25.48) 90.78,26.42 3.2,26.42 arc(0.94,25.48) 0,23.22
Stack: Top Layer 0.035mm / Dielectric1 1.51mm FR4 er 4.5 / Bottom Layer 0.035mm

## Design rules (mm)
template: JLCPCB Capability(Two Layers Board)
spacing copperThickness1oz (default): track to track 0.102, other pairs 0.152 to 0.3
spacing copperThickness2oz: track to track 0.203, other pairs 0.152 to 0.3
track width copperThickness1oz (default): min 0.127, default 0.254, max 2.54
track width copperThickness2oz: min 0.203, default 0.254, max 2.54
differential pair differentialPair (default): width min 0.127, default 0.254, max 2.54; gap min 0.152, default 0.152
via viaSize (default): diameter min 0.5, default 0.61, max 10; hole min 0.3, default 0.305, max 6.3

## Placement (name value [footprint] x y rotation side)
C1  0.1u  [C0805]  78.36 12.84 90 bottom
C2  0.1u  [C0805]  57.91 12.84 90 bottom
C3  0.1u  [C0805]  37.59 12.5 90 bottom
C4  0.1u  [C0805]  16.89 12.84 90 bottom
H1  -  [HDR-TH_5P-P2.54-V-F]  3.05 12.95 270 top
LED1  SLD0888HRC1BD  [LED-SEG-TH_16P-L20.0-W20.0-P2.50-S15.0-BL-1]  78.61 12.83 0 top
LED2  SLD0888HRC1BD  [LED-SEG-TH_16P-L20.0-W20.0-P2.50-S15.0-BL-1]  58.29 12.83 0 top
LED3  SLD0888HRC1BD  [LED-SEG-TH_16P-L20.0-W20.0-P2.50-S15.0-BL-1]  37.97 12.83 0 top
LED4  SLD0888HRC1BD  [LED-SEG-TH_16P-L20.0-W20.0-P2.50-S15.0-BL-1]  17.65 12.83 0 top
R1  10K  [R0603]  80.64 13.39 270 bottom
R2  10K  [R0603]  60.07 13.08 270 bottom
R3  10K  [R0603]  40.01 13.08 270 bottom
R4  10K  [R0603]  19.3 13.39 270 bottom
U1  MAX7219CWG+T  [SOIC-24_L15.4-W7.5-P1.27-LS10.3-BL]  78.49 12.83 0 top
U2  MAX7219CWG+T  [SOIC-24_L15.4-W7.5-P1.27-LS10.3-BL]  58.04 12.83 0 top
U3  MAX7219CWG+T  [SOIC-24_L15.4-W7.5-P1.27-LS10.3-BL]  37.85 12.83 0 top
U4  MAX7219CWG+T  [SOIC-24_L15.4-W7.5-P1.27-LS10.3-BL]  17.4 12.83 0 top

## Footprints (pads in the part's own frame, mm; a bottom-side part is the same pattern mirrored in y, then rotated)
C0805
  rect 1.41x1.35 smd: 1(-1,0) 2(1,0)
HDR-TH_5P-P2.54-V-F
  rect 1.575x1.575 hole 1.02: 1(-5.08,0)
  round 1.575 hole 1.02: 2(-2.54,0) 3(0,0) 4(2.54,0) 5(5.08,0)
LED-SEG-TH_16P-L20.0-W20.0-P2.50-S15.0-BL-1
  rect 1.524x1.524 hole 0.914: 1(-8.75,-7.5)
  round 1.524 hole 0.914: 2(-6.25,-7.5) 3(-3.75,-7.5) 4(-1.25,-7.5) 5(1.25,-7.5) 6(3.75,-7.5) 7(6.25,-7.5) 8(8.75,-7.5) 9(8.75,7.5) 10(6.25,7.5) 11(3.75,7.5) 12(1.25,7.5) 13(-1.25,7.5) 14(-3.75,7.5) 15(-6.25,7.5) 16(-8.75,7.5)
R0603
  rect 0.806x0.864 smd: 1(-0.753,0) 2(0.753,0)
SOIC-24_L15.4-W7.5-P1.27-LS10.3-BL
  oval 0.574x2.388 smd: 1(-6.985,-4.744) 2(-5.715,-4.744) 3(-4.445,-4.744) 4(-3.175,-4.744) 5(-1.905,-4.744) 6(-0.635,-4.744) 7(0.635,-4.744) 8(1.905,-4.744) 9(3.175,-4.744) 10(4.445,-4.744) 11(5.715,-4.744) 12(6.985,-4.744) 13(6.985,4.744) 14(5.715,4.744) 15(4.445,4.744) 16(3.175,4.744) 17(1.905,4.744) 18(0.635,4.744) 19(-0.635,4.744) 20(-1.905,4.744) 21(-3.175,4.744) 22(-4.445,4.744) 23(-5.715,4.744) 24(-6.985,4.744)

## Nets
As in the schematic.

Pads without a net: U1 24

## Via types
v1: diameter 3.5, hole 3, Top Layer to Bottom Layer, 4 vias
v2: diameter 0.61, hole 0.305, Top Layer to Bottom Layer, 46 vias

## Routing (per net, layer and track width the routed paths; a pad name or vN(x,y) marks a point on that pad's centre or on a via; arc(x,y) is an arc through that point)
GND: length 33.4
  Top Layer w0.254: v2(21.46,10.41) 20.57,9.53 U4.9 ; U1.9 81.66,9.65 v2(82.55,10.54) ; U1.4 v2(75.31,10.8) ; U2.9 61.21,9.78 61.6,10.16 v2(62.1,10.16) ; v2(14.61,11.94) 14.22,11.56 U4.4 ; U2.4 v2(54.86,10.41) ; v2(42.04,10.92) 41.02,9.91 U3.9 ; 34.67,8.08 v2(34.67,10.92)
  Bottom Layer w0.254: C4.1 16.79,11.94 v2(14.61,11.94) ; H1.2 v2(5.08,15.49) ; C2.1 57.89,11.81 v2(56.01,11.81) ; v2(35.94,11.43) 37.52,11.43 C3.1 ; C1.1 v2(76.33,11.84)
VCC: length 161.4
  Top Layer w0.254: U1.19 v2(77.85,15.75) ; U4.19 v2(16.76,15.88) ; U3.19 v2(37.21,15.75) ; U2.19 v2(57.4,15.75)
  Bottom Layer w0.254: v2(37.21,15.75) 37.21,15.11 37.72,14.61 37.72,13.63 C3.2 38.69,13.5 38.99,13.21 38.99,12.57 39.24,12.32 40,12.32 R3.2 ; R4.2 18.61,12.63 18.29,12.95 18.29,13.46 17.91,13.84 C4.2 16.76,13.96 v2(16.76,15.88) ; v2(77.85,15.75) 78.36,15.24 C1.2 79.38,13.84 79.63,13.59 79.63,12.83 79.88,12.57 80.59,12.57 R1.2 ; v2(57.4,15.75) 57.4,15.24 57.91,14.73 C2.2 58.81,13.84 59.05,13.59 59.05,12.7 59.44,12.32 60.06,12.32 R2.2
  Bottom Layer w0.305: C4.2 16.77,13.72 15.75,13.72 15.11,14.35 15.11,24.18 ; 15.11,24.77 15.7,24.77 ; 15.11,24.77 14.53,24.77 ; 15.11,24.77 15.11,24.18 ; 15.7,24.77 34.87,24.77 ; 15.7,24.77 arc(15.28,24.59) 15.11,24.18 ; 55.33,24.77 55.8,24.77 ; 55.33,24.77 35.91,24.77 ; 55.33,24.77 arc(55.66,24.63) 55.8,24.29 ; 55.8,24.77 55.8,24.29 ; 55.8,24.77 56.27,24.77 ; 55.8,24.29 55.8,14.43 56.39,13.84 57.91,13.84 C2.2 ; 55.8,24.29 arc(55.94,24.63) 56.27,24.77 ; 56.27,24.77 75.18,24.77 76.07,23.88 76.07,14.61 76.83,13.84 78.35,13.84 C1.2 ; 35.39,24.77 35.39,24.25 ; 35.39,24.77 35.91,24.77 ; 35.39,24.77 34.87,24.77 ; 35.39,24.25 35.39,14.14 36.07,13.46 37.55,13.46 C3.2 ; 35.39,24.25 arc(35.24,24.61) 34.87,24.77 ; 35.39,24.25 arc(35.54,24.61) 35.91,24.77 ; 14.53,24.77 8.13,24.77 3.05,19.69 H1.1 ; 14.53,24.77 arc(14.94,24.59) 15.11,24.18
(no net):
  vias: v1(2.97,23.48) v1(2.97,3.48) v1(90.97,23.48) v1(90.97,3.48)
1DIG0: length 40.9
  Top Layer w0.254: U1.2 72.77,9.53 72.52,9.78 68.96,9.78 68.45,10.29 68.45,22.48 69.72,23.75 86.99,23.75 87.36,23.38 LED1.9
1DIG1: length 29.9
  Top Layer w0.254: U1.11 84.2,13.08 86.23,15.11 86.23,22.86 85.73,23.37 75.44,23.37 74.86,22.79 LED1.14
1DIG2: length 14.3
  Top Layer w0.254: LED1.8 87.38,5.31 87.38,4.19 87.12,3.94 78.87,3.94 78.49,4.32 78.49,5.97 77.85,6.6 U1.6
1DIG3: length 22.5
  Top Layer w0.254: LED1.12 79.86,21.95 80.26,22.35 83.19,22.35 83.57,21.97 83.57,20.15 84.43,19.29 84.47,19.29 84.84,18.92 84.84,15.75 79.12,10.03 U1.7
1DIG4: length 6
  Top Layer w0.254: LED1.1 70.89,5.33 72.04,6.48 73.66,6.48 74.04,6.86 U1.3
1DIG5: length 4.2
  Top Layer w0.254: LED1.7 83.83,5.33 83.57,5.59 83.57,5.6 82.93,6.23 U1.10
1DIG6: length 6.2
  Top Layer w0.254: U1.5 76.58,6.73 76.33,6.48 74.54,6.48 73.82,5.76 73.82,5.75 73.4,5.33 LED1.2
1DIG7: length 3
  Top Layer w0.254: U1.8 80.39,6.86 79.86,6.33 LED1.5
1SEGA: length 17.2
  Top Layer w0.254: U1.14 84.2,16 78.11,9.91 77.47,9.91 77.22,9.65 77.22,6.65 75.77,5.21 74.98,5.21 LED1.3
1SEGB: length 22.4
  Top Layer w0.254: U1.16 v2(81.66,15.62)
  Bottom Layer w0.254: v2(81.66,15.62) 82.93,15.62 83.57,14.99 83.57,4.44 82.93,3.81 77.85,3.81 77.34,4.32 77.34,5.31 LED1.4
1SEGC: length 15.1
  Top Layer w0.254: U1.20 76.58,18.92 76.83,19.18 78.11,19.18 78.61,19.69 78.61,22.35 79.12,22.86 84.45,22.86 84.86,22.45 LED1.10
1SEGD: length 20.9
  Top Layer w0.254: U1.23 v2(72.77,15.49)
  Bottom Layer w0.254: LED1.6 82.3,5.39 82.3,6.98 81.79,7.49 73.79,7.49 72.77,8.51 v2(72.77,15.49)
1SEGDP: length 5.2
  Top Layer w0.254: U1.22 74.04,18.8 74.42,19.18 76.21,19.18 LED1.13
1SEGE: length 41.3
  Top Layer w0.254: v2(73.66,21.84) 69.72,21.84 68.81,20.93 68.81,14.8 69.89,13.72 81.15,13.72 83.5,16.06 83.5,18.86 82.36,19.99 LED1.11 ; v2(75.31,15.49) U1.21
  Bottom Layer w0.254: v2(73.66,21.84) 73.66,19.81 75.31,18.16 v2(75.31,15.49)
1SEGF: length 20.6
  Top Layer w0.254: U1.15 82.93,18.92 82.68,19.18 80.14,19.18 79.76,18.8 79.76,15.37 79.12,14.73 73.79,14.73 73.41,15.11 73.41,19.28 LED1.15
1SEGG: length 19
  Top Layer w0.254: LED1.16 69.85,20.31 69.85,14.73 70.36,14.22 79.25,14.22 80.39,15.37 U1.17
2DIG0: length 40.6
  Top Layer w0.254: LED2.9 67.04,23.13 66.42,23.75 49.4,23.75 48.13,22.48 48.13,10.54 48.64,10.03 51.94,10.03 52.32,9.65 U2.2
2DIG1: length 29.9
  Top Layer w0.254: LED2.14 54.54,22.79 55.12,23.37 65.41,23.37 65.79,22.99 65.79,14.86 63.75,12.83 U2.11
2DIG2: length 14
  Top Layer w0.254: U2.6 57.4,6.73 58.17,5.97 58.17,4.57 58.67,4.06 66.67,4.06 67.06,4.44 67.06,5.31 LED2.8
2DIG3: length 21.8
  Top Layer w0.254: LED2.12 59.54,21.7 59.94,22.1 62.74,22.1 63.12,21.72 63.12,20.28 64.11,19.29 64.15,19.29 64.39,19.05 64.39,15.49 58.67,9.78 U2.7
2DIG4: length 6
  Top Layer w0.254: U2.3 53.59,6.73 53.34,6.48 51.18,6.48 50.03,5.33 LED2.1
2DIG5: length 4.2
  Top Layer w0.254: LED2.7 64.29,5.33 64.17,5.21 63.75,5.21 62.48,6.48 U2.10
2DIG6: length 6
  Top Layer w0.254: LED2.2 52.95,5.33 54.1,6.48 55.88,6.48 56.13,6.73 U2.5
2DIG7: length 3
  Top Layer w0.254: LED2.5 59.44,5.43 59.44,6.48 59.94,6.98 U2.8
2SEGA: length 17.3
  Top Layer w0.254: LED2.3 55.57,5.33 56.77,6.53 56.77,9.78 57.15,10.16 58.17,10.16 63.75,15.75 U2.14
2SEGB: length 45.1
  Top Layer w0.254: U2.16 v2(61.21,15.49)
  Bottom Layer w0.254: v2(61.21,15.49) 62.48,15.49 62.74,15.24 62.74,9.78 62.36,9.4 54.1,9.4 53.72,9.78 53.72,16.64 53.21,17.14 51.18,17.14 50.42,16.38 50.42,9.53 53.09,6.86 56.64,6.86 57.04,6.46 LED2.4
2SEGC: length 15.1
  Top Layer w0.254: U2.20 56.13,18.92 56.39,19.18 58.04,19.18 58.29,19.43 58.29,22.22 58.8,22.73 64.14,22.73 64.54,22.33 LED2.10
2SEGD: length 21.2
  Top Layer w0.254: U2.23 v2(52.32,15.62)
  Bottom Layer w0.254: v2(52.32,15.62) 52.32,8.38 53.21,7.49 61.6,7.49 61.98,7.11 61.98,5.39 LED2.6
2SEGDP: length 5.4
  Top Layer w0.254: LED2.13 56.14,20.33 54.99,19.18 53.85,19.18 53.59,18.92 U2.22
2SEGE: length 40.8
  Top Layer w0.254: v2(53.34,22.1) 49.15,22.1 48.49,21.44 48.49,15.27 49.66,14.1 61.21,14.1 63.12,16 63.12,19.25 LED2.11 ; v2(54.86,15.75) U2.21
  Bottom Layer w0.254: v2(54.86,15.75) 54.86,18.16 53.34,19.69 v2(53.34,22.1)
2SEGF: length 19.9
  Top Layer w0.254: LED2.15 52.96,19.41 52.96,15.49 53.4,15.05 58.74,15.05 59.31,15.62 59.31,18.8 59.69,19.18 62.23,19.18 62.48,18.92 U2.15
2SEGG: length 18.3
  Top Layer w0.254: LED2.16 49.54,15.23 50.17,14.61 59.18,14.61 59.94,15.37 U2.17
3DIG0: length 40.4
  Top Layer w0.254: LED3.9 46.72,23 45.97,23.75 28.96,23.75 27.81,22.61 27.81,11.3 28.83,10.29 31.75,10.29 32.13,9.91 32.13,8.08
3DIG1: length 29.6
  Top Layer w0.254: LED3.14 34.22,22.67 34.8,23.24 45.08,23.24 45.59,22.73 45.59,15.11 43.56,13.08 U3.11
3DIG2: length 14
  Top Layer w0.254: LED3.8 46.74,5.31 46.74,4.32 46.36,3.94 38.61,3.94 37.97,4.57 37.97,5.84 37.21,6.6 U3.6
3DIG3: length 21.9
  Top Layer w0.254: LED3.12 39.22,21.7 39.62,22.1 42.55,22.1 43.05,21.59 43.05,19.94 44.2,18.8 44.2,15.37 38.48,9.65 U3.7
3DIG4: length 6.1
  Top Layer w0.254: LED3.1 29.71,5.33 30.86,6.48 33.15,6.48 33.4,6.73 U3.3
3DIG5: length 4.2
  Top Layer w0.254: LED3.7 43.06,5.33 42.8,5.59 42.8,6.48 42.29,6.98 42.29,8.08
3DIG6: length 6
  Top Layer w0.254: LED3.2 32.76,5.33 33.18,5.75 33.18,5.76 33.79,6.37 34.65,6.37 34.67,6.35 35.31,6.35 35.94,6.98 U3.5
3DIG7: length 3
  Top Layer w0.254: U3.8 39.75,6.86 39.22,6.33 LED3.5
3SEGA: length 17.3
  Top Layer w0.254: LED3.3 35.05,5.33 36.58,6.86 36.58,9.78 36.96,10.16 38.1,10.16 43.56,15.62 U3.14
3SEGB: length 45.2
  Top Layer w0.254: U3.16 v2(41.02,15.88)
  Bottom Layer w0.254: LED3.4 36.7,5.35 36.7,6.6 36.32,6.98 32.64,6.98 30.23,9.4 30.23,16.76 30.99,17.53 32.89,17.53 33.53,16.89 33.53,10.41 34.29,9.65 42.29,9.65 42.8,10.16 42.8,15.11 42.04,15.88 v2(41.02,15.88)
3SEGC: length 14.7
  Top Layer w0.254: LED3.10 44.22,22.07 43.69,22.61 38.48,22.61 37.97,22.1 37.97,19.43 37.72,19.18 36.2,19.18 35.94,18.92 U3.20
3SEGD: length 21.1
  Top Layer w0.254: 32.13,17.57 v2(32.13,15.75)
  Bottom Layer w0.254: v2(32.13,15.75) 32.13,8.13 32.77,7.49 41.15,7.49 41.66,6.98 41.66,5.39 LED3.6
3SEGDP: length 5.3
  Top Layer w0.254: U3.22 33.4,18.92 33.66,19.18 34.54,19.18 35.69,20.33 LED3.13
3SEGE: length 41
  Top Layer w0.254: v2(32.89,22.1) 28.96,22.1 28.19,21.34 28.19,20.77 28.18,20.76 28.18,19.9 28.19,19.88 28.19,14.99 29.34,13.84 40.77,13.84 42.93,16 42.93,19.12 LED3.11 ; 34.67,17.57 34.67,16.13 v2(34.42,15.88)
  Bottom Layer w0.254: v2(32.89,22.1) 32.89,19.94 34.42,18.41 v2(34.42,15.88)
3SEGF: length 20
  Top Layer w0.254: 42.29,17.57 42.29,18.92 42.04,19.18 39.5,19.18 39.12,18.8 39.12,15.62 39.07,15.57 39.07,15.51 38.67,15.11 33.15,15.11 32.77,15.49 32.77,19.28 LED3.15
3SEGG: length 18.8
  Top Layer w0.254: LED3.16 29.21,20.31 29.21,15.11 29.97,14.35 38.86,14.35 39.75,15.24 U3.17
4DIG0: length 40.4
  Top Layer w0.254: U4.2 11.68,9.53 11.18,10.03 8.26,10.03 7.37,10.92 7.37,22.48 8.64,23.75 25.65,23.75 26.4,23 LED4.9
4DIG1: length 29.6
  Top Layer w0.254: LED4.14 13.9,22.67 14.48,23.24 24.64,23.24 25.27,22.61 25.27,14.73 23.11,12.57 U4.11
4DIG2: length 14
  Top Layer w0.254: LED4.8 26.4,4.3 26.16,4.06 18.16,4.06 17.65,4.57 17.65,5.72 16.76,6.6 U4.6
4DIG3: length 22.1
  Top Layer w0.254: LED4.12 18.9,21.82 19.3,22.22 22.23,22.22 22.73,21.72 22.73,19.94 23.75,18.92 23.75,15.37 18.03,9.65 U4.7
4DIG4: length 6.2
  Top Layer w0.254: LED4.1 10.03,5.33 10.29,5.59 10.29,6.1 10.67,6.48 12.57,6.48 12.95,6.86 U4.3
4DIG5: length 4.1
  Top Layer w0.254: LED4.7 22.99,5.33 21.84,6.48 U4.10
4DIG6: length 6.2
  Top Layer w0.254: U4.5 15.49,6.86 15.11,6.48 13.21,6.48 12.83,6.1 12.83,5.59 12.57,5.33 LED4.2
4DIG7: length 2.9
  Top Layer w0.254: LED4.5 18.9,6.33 19.3,6.73 U4.8
4SEGA: length 17.1
  Top Layer w0.254: LED4.3 14.85,5.33 16.13,6.6 16.13,9.4 16.51,9.78 17.4,9.78 23.11,15.49 U4.14
4SEGB: length 46
  Top Layer w0.254: U4.16 v2(20.57,15.37)
  Bottom Layer w0.254: v2(20.57,15.37) 21.97,15.37 22.35,14.99 22.35,9.91 22.1,9.65 13.59,9.65 12.95,10.29 12.95,16.38 12.19,17.14 10.16,17.14 9.65,16.64 9.65,8.25 11.05,6.86 16.13,6.86 16.4,6.58 LED4.4
4SEGC: length 15
  Top Layer w0.254: U4.20 15.49,18.8 15.88,19.18 16.89,19.18 17.53,19.81 17.53,22.35 17.91,22.73 23.62,22.73 23.9,22.45 LED4.10
4SEGD: length 21.3
  Top Layer w0.254: U4.23 v2(11.68,15.62)
  Bottom Layer w0.254: v2(11.68,15.62) 11.68,8 12.32,7.37 20.95,7.37 21.34,6.98 21.34,5.39 LED4.6
4SEGDP: length 5.3
  Top Layer w0.254: U4.22 12.95,18.8 13.34,19.18 14.22,19.18 15.37,20.33 LED4.13
4SEGE: length 40.8
  Top Layer w0.254: LED4.11 22.48,19.25 22.48,15.88 20.32,13.72 8.76,13.72 7.81,14.67 7.81,21.15 8.13,21.46 v2(12.7,21.46) ; v2(14.22,15.62) U4.21
  Bottom Layer w0.254: v2(12.7,21.46) 12.7,18.54 14.22,17.02 v2(14.22,15.62)
4SEGF: length 20.5
  Top Layer w0.254: U4.15 21.84,18.92 21.59,19.18 19.05,19.18 18.67,18.8 18.67,15.11 18.42,14.86 12.83,14.86 12.32,15.37 12.32,19.41 LED4.15
4SEGG: length 18.9
  Top Layer w0.254: LED4.16 8.89,20.31 8.89,14.99 9.53,14.35 18.67,14.35 19.3,14.99 U4.17
CLK: length 174.1
  Top Layer w0.254: U1.13 85.47,15.49 83.57,13.59 83.57,6.98 84.07,6.48 87.76,6.48 88.65,5.59 88.65,3.43 87.76,2.54 68.48,2.54 ; 28.25,2.54 47.64,2.54 ; 28.25,2.54 27.79,2.54 ; 28.25,2.54 arc(27.92,2.67) 27.79,3 ; 47.64,2.54 48.13,2.54 ; 47.64,2.54 arc(47.99,2.69) 48.13,3.04 ; 67.94,2.54 68.48,2.54 ; 67.94,2.54 48.63,2.54 ; 67.94,2.54 arc(68.32,2.7) 68.48,3.08 ; 68.48,2.54 68.48,3.08 ; 27.79,2.54 27.79,3 ; 27.79,2.54 27.33,2.54 ; 27.79,3 27.79,5.74 27.05,6.48 23.01,6.48 22.55,6.94 22.55,7.04 22.48,7.11 22.48,13.08 24.38,14.99 U4.13 ; 27.79,3 arc(27.65,2.67) 27.33,2.54 ; 48.13,2.54 48.13,3.04 ; 48.13,2.54 48.63,2.54 ; U3.13 44.83,15.24 42.93,13.33 42.93,7.11 42.99,7.04 42.99,6.94 43.33,6.6 47.37,6.6 48.13,5.84 48.13,3.04 ; 27.33,2.54 7.11,2.54 3.05,6.6 H1.5 ; 48.13,3.04 arc(48.28,2.69) 48.63,2.54 ; 68.48,3.08 68.48,5.81 67.69,6.6 63.5,6.6 63.12,6.98 63.12,13.21 65.02,15.11 U2.13 ; 68.48,3.08 arc(68.64,2.7) 69.02,2.54
CS: length 127.8
  Top Layer w0.254: U3.12 44.88,8.13 v2(45.97,8.13) ; v2(87.25,8.13) 85.52,8.13 U1.12 ; v2(25.65,8) 25.06,8 ; 25.06,8 25.02,7.96 ; 25.06,8 24.47,8 U4.12 ; v2(66.29,8.13) 65.07,8.13 U2.12
  Bottom Layer w0.254: 47.74,2.54 48.21,2.54 ; 47.74,2.54 28.05,2.54 ; 47.74,2.54 arc(48.07,2.68) 48.21,3 ; 48.21,2.54 48.67,2.54 ; 48.21,2.54 48.21,3 ; 68.76,2.54 87.63,2.54 88.52,3.43 88.52,6.86 v2(87.25,8.13) ; 68.76,2.54 68.33,2.54 ; 68.76,2.54 arc(68.45,2.67) 68.33,2.97 ; 27.76,2.54 28.05,2.54 ; 27.76,2.54 27.74,2.52 27.49,2.52 27.47,2.54 ; 27.76,2.54 27.8,2.58 27.8,2.68 ; 28.05,2.54 arc(27.91,2.58) 27.8,2.68 ; H1.4 4.57,10.41 4.95,10.03 4.95,5.33 7.75,2.54 27.47,2.54 ; 68.33,2.54 68.33,2.97 ; 68.33,2.54 67.89,2.54 ; 68.33,2.97 68.33,7.37 67.56,8.13 v2(66.29,8.13) ; 68.33,2.97 arc(68.2,2.67) 67.89,2.54 ; 48.67,2.54 67.89,2.54 ; 48.67,2.54 arc(48.34,2.68) 48.21,3 ; v2(45.97,8.13) 46.99,8.13 48.21,6.91 48.21,3 ; 27.8,2.68 27.8,2.83 27.76,2.83 ; 27.8,2.68 arc(27.77,2.76) 27.76,2.83 ; 27.76,2.83 27.76,7.04 26.8,8 v2(25.65,8) ; 27.76,2.83 arc(27.68,2.63) 27.47,2.54
DIN: length 30.8
  Top Layer w0.254: U1.1 71.42,8 v2(70.1,8) ; U2.24 v2(51.05,15.62)
  Bottom Layer w0.254: v2(51.05,15.62) 51.05,16.26 51.44,16.64 52.83,16.64 53.21,16.26 53.21,9.4 53.59,9.02 69.09,9.02 v2(70.1,8)
$1N1570: length 4.5
  Top Layer w0.254: U1.18 v2(79.12,15.75)
  Bottom Layer w0.254: R1.1 80.64,14.99 79.88,15.75 v2(79.12,15.75)
$1N1807: length 4.4
  Top Layer w0.254: v2(58.55,15.88) 58.67,16 U2.18
  Bottom Layer w0.254: R2.1 60.07,14.35 v2(58.55,15.88)
$1N1816: length 30.7
  Top Layer w0.254: v2(49.53,8.13) 51.01,8.13 U2.1 ; U3.24 v2(30.86,15.62)
  Bottom Layer w0.254: v2(49.53,8.13) 48.89,8.76 33.78,8.76 33.02,9.53 33.02,16.26 32.39,16.89 31.37,16.89 30.86,16.38 v2(30.86,15.62)
$1N1982: length 4.9
  Top Layer w0.254: U3.18 v2(38.48,15.75)
  Bottom Layer w0.254: v2(38.48,15.75) 39.37,15.75 40.01,15.11 R3.1
$1N1984: length 30.6
  Top Layer w0.254: U3.1 30.82,8.13 v2(29.59,8.13) ; U4.24 v2(10.41,15.62)
  Bottom Layer w0.254: v2(29.59,8.13) 29.08,8.64 13.08,8.64 12.45,9.27 12.45,16.13 12.06,16.51 10.67,16.51 10.41,16.26 v2(10.41,15.62)
$1N2147: length 4.5
  Top Layer w0.254: U4.18 v2(18.03,15.88)
  Bottom Layer w0.254: v2(18.03,15.88) 18.03,14.61 18.54,14.1 19.26,14.1 R4.1
$1N2277: length 11.8
  Top Layer w0.254: H1.3 4.83,12.95 5.08,12.7 5.08,8.64 5.72,8 10.33,8 U4.1

## Copper pours and planes (outline as drawn; the poured copper is in the pictures)
GND on Top Layer: -5.33,31.37 110.24,31.37 110.24,-13.72 -5.33,-13.72
GND on Bottom Layer: -7.24,29.84 110.74,29.84 110.74,-18.16 -7.24,-18.16
